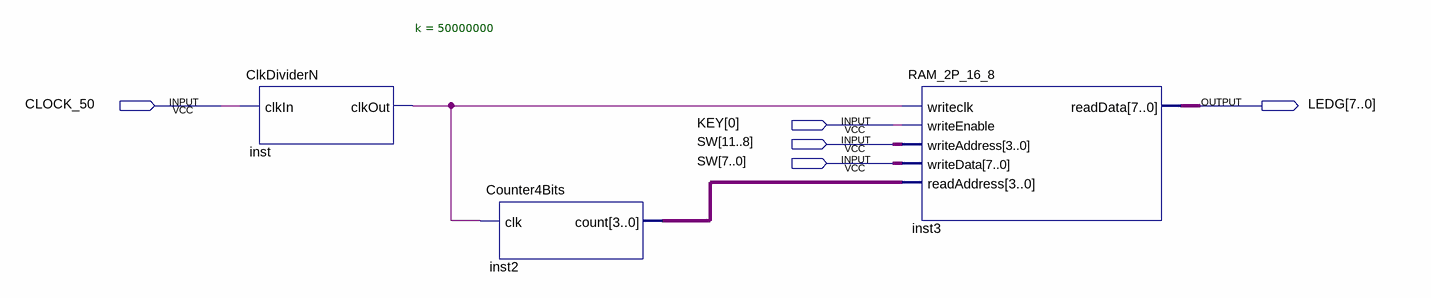
[diagram p0: schematic sheet]
// Quartus schematic RAM_2P_Demo.bdf as structural Verilog: 3 symbols, 5 pins
module RAM_2P_Demo (
  input  CLOCK_50,
  input  [0:0] KEY,
  input  [11:0] SW,
  output [7:0] LEDG
);

  wire inst_clkout;
  wire [3:0] inst2_count;

  ClkDividerN #(.k(50000000)) inst (.clkIn(CLOCK_50), .clkOut(inst_clkout));
  Counter4Bits inst2 (.clk(inst_clkout), .count(inst2_count));
  RAM_2P_16_8 inst3 (
    .writeclk(inst_clkout), .writeEnable(KEY[0]), .writeAddress(SW[11:8]), .writeData(SW[7:0]),
    .readAddress(inst2_count), .readData(LEDG));
endmodule
